# Altium project DM3370.PrjPcb (part 8 of 14)

## Sheet DM3370_Power.SchDoc: =project_title
size Tabloid; CompanyName: Luxonis Holding; DrawnBy: David Malovrh; Organization: Luxonis Holding; Address1: 7901 Shaffer Parkway; Address2: Littleton, CO; Address3: 80127; Address4: United States; DocumentNumber: 3; Revision: R5M2E5; SheetNumber: 3; SheetTotal: 17
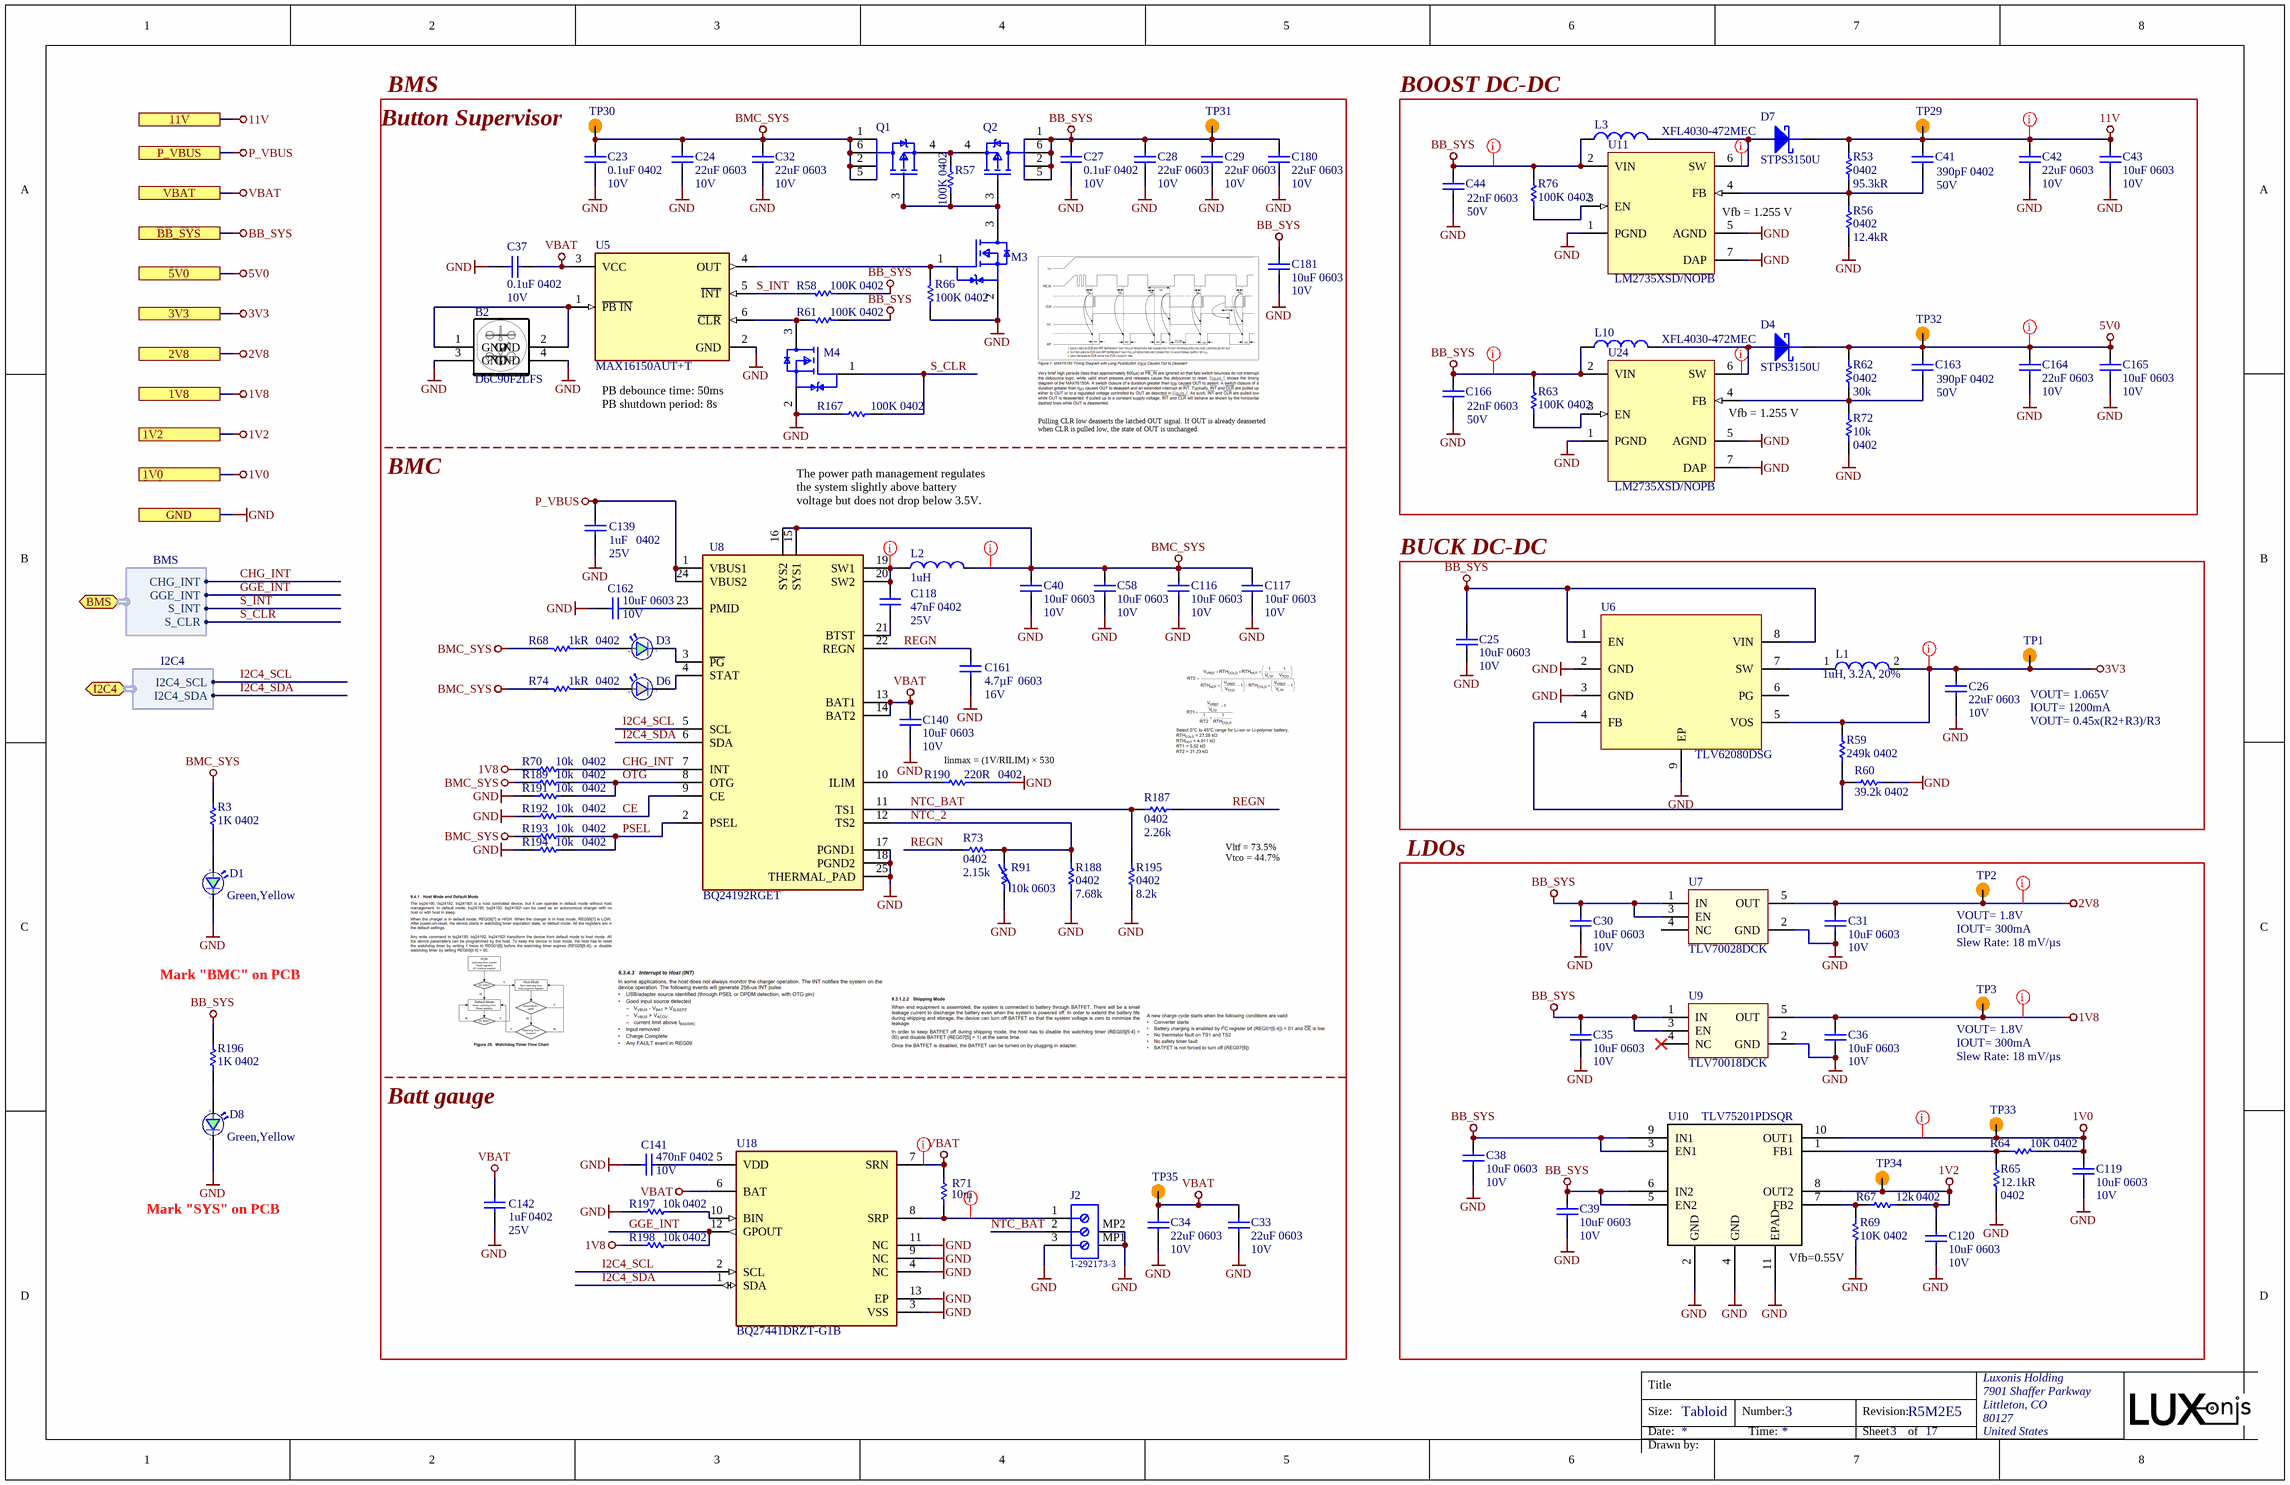
[diagram p13: DM3370_Power.SchDoc]

### Parts
B2  D6C90F2LFS  [CON_B_BW2099_SoM_DF40HC-3.0-100DS-0.4V_minpad]
C23  0.1uF 0402  Voltage Rating: 10V  [CAPC0402(1005)70_L]
C24  22uF 0603  Voltage Rating: 10V  [CAPC0603(1608)100_L]
C25  10uF 0603  Voltage Rating: 10V  [CAPC0603(1608)100_L]
C26  22uF 0603  Voltage Rating: 10V  [CAPC0603(1608)100_L]
C27  0.1uF 0402  Voltage Rating: 10V  [CAPC0402(1005)70_L]
C28  22uF 0603  Voltage Rating: 10V  [CAPC0603(1608)100_L]
C29  22uF 0603  Voltage Rating: 10V  [CAPC0603(1608)100_L]
C30  10uF 0603  Voltage Rating: 10V  [CAPC0603(1608)100_L]
C31  10uF 0603  Voltage Rating: 10V  [CAPC0603(1608)100_L]
C32  22uF 0603  Voltage Rating: 10V  [CAPC0603(1608)100_L]
C33  22uF 0603  Voltage Rating: 10V  [CAPC0603(1608)100_L]
C34  22uF 0603  Voltage Rating: 10V  [CAPC0603(1608)100_L]
C35  10uF 0603  Voltage Rating: 10V  [CAPC0603(1608)100_L]
C36  10uF 0603  Voltage Rating: 10V  [CAPC0603(1608)100_L]
C37  0.1uF 0402  Voltage Rating: 10V  [CAPC0402(1005)70_L]
C38  10uF 0603  Voltage Rating: 10V  [CAPC0603(1608)100_L]
C39  10uF 0603  Voltage Rating: 10V  [CAPC0603(1608)100_L]
C40  10uF 0603  Voltage Rating: 10V  [CAPC0603(1608)100_L]
C41  Rated DC Voltage (URdc): 50V  Capacitance: 390pF  Size Code: 0402  [CAPC0402(1005)60_L]  (hidden comment: GRM1555C1H391JA01J)
C42  22uF 0603  Voltage Rating: 10V  [CAPC0603(1608)100_L]
C43  10uF 0603  Voltage Rating: 10V  [CAPC0603(1608)100_L]
C44  Voltage Rating: 50V  Case Code (Imperial): 0603  Capacitance: 22nF  [CAPC0603(1608)100_L]  (hidden comment: C0603C223K5RACTU)
C58  10uF 0603  Voltage Rating: 10V  [CAPC0603(1608)100_L]
C116  10uF 0603  Voltage Rating: 10V  [CAPC0603(1608)100_L]
C117  10uF 0603  Voltage Rating: 10V  [CAPC0603(1608)100_L]
C118  Case Code (Imperial): 0402  Capacitance: 47nF  Voltage: 25V  [CAPC0402(1005)70_L]  (hidden comment: GRM155R71E473KA88D)
C119  10uF 0603  Voltage Rating: 10V  [CAPC0603(1608)100_L]
C120  10uF 0603  Voltage Rating: 10V  [CAPC0603(1608)100_L]
C139  Case Code (Imperial): 0402  Voltage: 25V  Capacitance: 1uF  [CAPC0402(1005)70_L]  (hidden comment: GRM155R61E105KA12D)
C140  10uF 0603  Voltage Rating: 10V  [CAPC0603(1608)100_L]
C141  Voltage Rating: 10V  Capacitance: 470nF  Case/Package: 0402  [CAPC0402(1005)70_L]  (hidden comment: GRM155R61A474KE15D)
C142  Case Code (Imperial): 0402  Voltage: 25V  Capacitance: 1uF  [CAPC0402(1005)70_L]  (hidden comment: GRM155R61E105KA12D)
C161  value 4.7µF  Voltage Rating: 16V  Case/Package: 0603  [CAPC0603(1608)100_L]  (hidden comment: GRM188R61C475KAAJD)
C162  10uF 0603  Voltage Rating: 10V  [CAPC0603(1608)100_L]
C163  Rated DC Voltage (URdc): 50V  Capacitance: 390pF  Size Code: 0402  [CAPC0402(1005)60_L]  (hidden comment: GRM1555C1H391JA01J)
C164  22uF 0603  Voltage Rating: 10V  [CAPC0603(1608)100_L]
C165  10uF 0603  Voltage Rating: 10V  [CAPC0603(1608)100_L]
C166  Voltage Rating: 50V  Case Code (Imperial): 0603  Capacitance: 22nF  [CAPC0603(1608)100_L]  (hidden comment: C0603C223K5RACTU)
C180  22uF 0603  Voltage Rating: 10V  [CAPC0603(1608)100_L]
C181  10uF 0603  Voltage Rating: 10V  [CAPC0603(1608)100_L]
D1  Color: Green,Yellow  [SML_D1xx8W]  (hidden comment: SML-D12M8WT86)
D3  SML-D12M8WT86  [SML_D1xx8W]  (value not drawn)
D4  STPS3150U  [FP-SMB-MFG]
D6  SML-D12D8WT86  [SML_D1xx8W]  (value not drawn)
D7  STPS3150U  [FP-SMB-MFG]
D8  Color: Green,Yellow  [SML_D1xx8W]  (hidden comment: SML-D12M8WT86)
J2  1-292173-3  [1-292173-3]
L1  1uH, 3.2A, 20%  [DFE252012P-1R0M=P2]
L2  Inductance: 1uH  [COIL-XFL4020_V]  (hidden comment: XFL4020-102MEC)
L3  XFL4030-472MEC  [XFL4030-472MEC-MFG]
L10  XFL4030-472MEC  [XFL4030-472MEC-MFG]
M3  RE1C002UNTCL  [RE1C002UNTCL]  (value not drawn)
M4  RE1C002UNTCL  [RE1C002UNTCL]  (value not drawn)
Q1  IRLTS2242TRPBF  [TSOP-6-MFG]  (value not drawn)
Q2  IRLTS2242TRPBF  [TSOP-6-MFG]  (value not drawn)
R3  1K 0402  [RESC0402(1005)_L]
R53  Case Code (Imperial): 0402  Resistance: 95.3kR  [RESC0402(1005)_L]  (hidden comment: CRCW040295K3FKED)
R56  Case Code (Imperial): 0402  Resistance: 12.4kR  [RESC0402(1005)_L]  (hidden comment: RC0402FR-0712K4L)
R57  100K 0402  [RESC0402(1005)_L]
R58  100K 0402  [RESC0402(1005)_L]
R59  249k 0402  [RESC0402(1005)_L]
R60  39.2k 0402  [RESC0402(1005)_L]
R61  100K 0402  [RESC0402(1005)_L]
R62  value 30k  Case/Package: 0402  [RESC0402(1005)_L]  (hidden comment: RC0402FR-0730KL)
R63  100K 0402  [RESC0402(1005)_L]
R64  10K 0402  [RESC0402(1005)_L]
R65  Resistance: 12.1kR  Size Code: 0402  [RESC0402(1005)_L]  (hidden comment: RC0402FR-0712K1L)
R66  100K 0402  [RESC0402(1005)_L]
R67  value 12k  Case/Package: 0402  [RESC0402(1005)_L]  (hidden comment: RC0402FR-0712KL)
R68  Case Code (Imperial): 0402  Resistance: 1kR  [RESC0402(1005)_L]  (hidden comment: RC0402FR-071KL)
R69  10K 0402  [RESC0402(1005)_L]
R70  value 10k  Case/Package: 0402  [RESC0402(1005)_L]  (hidden comment: RC0402FR-1310KL)
R71  value 10m  [RESC0805(2012)_M]  (hidden comment: ERJ-6BWFR010V)
R72  value 10k  Case/Package: 0402  [RESC0402(1005)_L]  (hidden comment: RC0402FR-1310KL)
R73  value 2.15k  Case/Package: 0402  [RESC0402(1005)_L]  (hidden comment: CRCW04022K15FKED)
R74  Case Code (Imperial): 0402  Resistance: 1kR  [RESC0402(1005)_L]  (hidden comment: RC0402FR-071KL)
R76  100K 0402  [RESC0402(1005)_L]
R91  value 10k  Case/Package: 0603  [RESC0603(1608)_N]  (hidden comment: NTCG163JF103FT1)
R167  100K 0402  [RESC0402(1005)_L]
R187  value 2.26k  Case/Package: 0402  [RESC0402(1005)_L]  (hidden comment: CRCW04022K26FKED)
R188  value 7.68k  Case/Package: 0402  [RESC0402(1005)_L]  (hidden comment: CRCW04027K68FKTD)
R189  value 10k  Case/Package: 0402  [RESC0402(1005)_L]  (hidden comment: RC0402FR-1310KL)
R190  Resistance: 220R  Case Code (Imperial): 0402  [RESC0402(1005)_L]  (hidden comment: RC0402FR-07220RL)
R191  value 10k  Case/Package: 0402  [RESC0402(1005)_L]  (hidden comment: RC0402FR-1310KL)
R192  value 10k  Case/Package: 0402  [RESC0402(1005)_L]  (hidden comment: RC0402FR-1310KL)
R193  value 10k  Case/Package: 0402  [RESC0402(1005)_L]  (hidden comment: RC0402FR-1310KL)
R194  value 10k  Case/Package: 0402  [RESC0402(1005)_L]  (hidden comment: RC0402FR-1310KL)
R195  value 8.2k  Case/Package: 0402  [RESC0402(1005)_L]  (hidden comment: CR0402-FX-8201GLF)
R196  1K 0402  [RESC0402(1005)_L]
R197  value 10k  Case/Package: 0402  [RESC0402(1005)_L]  (hidden comment: RC0402FR-1310KL)
R198  value 10k  Case/Package: 0402  [RESC0402(1005)_L]  (hidden comment: RC0402FR-1310KL)
TP1  TP100_200_NS  [TP100_200_NS]  (value not drawn)  (no BOM)
TP2  TP100_200_NS  [TP100_200_NS]  (value not drawn)  (no BOM)
TP3  TP100_200_NS  [TP100_200_NS]  (value not drawn)  (no BOM)
TP29  TP100_200_NS  [TP100_200_NS]  (value not drawn)  (no BOM)
TP30  TP100_200_NS  [TP100_200_NS]  (value not drawn)  (no BOM)
TP31  TP100_200_NS  [TP100_200_NS]  (value not drawn)  (no BOM)
TP32  TP100_200_NS  [TP100_200_NS]  (value not drawn)  (no BOM)
TP33  TP100_200_NS  [TP100_200_NS]  (value not drawn)  (no BOM)
TP34  TP100_200_NS  [TP100_200_NS]  (value not drawn)  (no BOM)
TP35  TP100_200_NS  [TP100_200_NS]  (value not drawn)  (no BOM)
U5  MAX16150AUT+T  [FP-U6-1-MFG]
U6  TLV62080DSG  [TLV62080DSG]
U7  TLV70028DCK  [TLV70028DCK]
U8  BQ24192RGET  [BQ24192IRGET-Footprint-1]
U9  TLV70018DCK  [TLV70018DCK]
U10  TLV75201PDSQR  [SON_1PDSQR_TEX]
U11  LM2735XSD/NOPB  [NGG0006A_V]
U18  BQ27441DRZT-G1B  [FP-DRZ0012A-MFG]
U24  LM2735XSD/NOPB  [NGG0006A_V]

### Blocks framed on the sheet
BOOST DC-DC: C41-C44 C163-C166 D4 D7 L3 L10 R53 R56 R62 R63 R72 R76 TP29 TP32 U11 U24
BUCK DC-DC: C25 C26 L1 R59 R60 TP1 U6
LDOs: C30 C31 C35 C36 C38 C39 C119 C120 R64 R65 R67 R69 TP2 TP3 TP33 TP34 U7 U9 U10

### Ports
1V0, 1V2, 1V8, 2V8, 3V3, 5V0, 11V, BB_SYS, BMS (bidir, harness BMS), GND, I2C4 (bidir, harness I2C4), P_VBUS, VBAT

### Harnesses
I2C4: I2C4_SCL, I2C4_SDA
BMS: CHG_INT, GGE_INT, S_INT, S_CLR

### Nets
1V0: C119.2 R64.2 TP33.1 U10.10(OUT1) ; port 1V0
1V2: C120.2 R67.1 TP34.1 U10.8(OUT2) ; port 1V2
1V8: C36.2 R70.1 R198.1 TP3.1 U9.5(OUT) ; port 1V8
2V8: C31.2 TP2.1 U7.5(OUT) ; port 2V8
3V3: C26.2 L1.2 R59.2 TP1.1 U6.5(VOS) ; port 3V3
5V0: C163.1 C164.2 C165.2 D4.1(K) R62.2 TP32.1 ; port 5V0
11V: C41.1 C42.2 C43.2 D7.1(K) R53.2 TP29.1 ; port 11V
BB_SYS: C25.2 C27.1 C28.2 C29.2 C30.2 C35.2 C38.2 C39.2 C44.2 C166.2 C180.2 C181.2 L3.1 L10.1 Q2.1(D) Q2.2(D) Q2.5(D) Q2.6(D) R58.2 R61.2 R63.2 R76.2 R196.2 TP31.1 U6.1(EN) U6.8(VIN) U7.1(IN) U7.3(EN) U9.1(IN) U9.3(EN) U10.3(EN1) U10.5(EN2) U10.6(IN2) U10.9(IN1) U11.2(VIN) U24.2(VIN) ; port BB_SYS
BMC_SYS: C23.1 C24.2 C32.2 C40.2 C58.2 C116.2 C117.2 L2.2 Q1.1(D) Q1.2(D) Q1.5(D) Q1.6(D) R3.2 R68.1 R74.1 R189.1 R193.1 TP30.1 U8.15(SYS1) U8.16(SYS2)
GND: B2.3(GND) B2.4(GND) C23.2 C24.1 C25.1 C26.1 C27.2 C28.1 C29.1 C30.1 C31.1 C32.1 C33.1 C34.1 C35.1 C36.1 C37.2 C38.1 C39.1 C40.1 C42.1 C43.1 C44.1 C58.1 C116.1 C117.1 C119.1 C120.1 C139.2 C140.1 C141.2 C142.2 C161.1 C162.2 C164.1 C165.1 C166.1 C180.1 C181.1 D1.1(C) D8.1(C) J2.3 J2.MP1 J2.MP2 M3.2(Source) M4.2(Source) R56.1 R60.1 R65.1 R66.1 R69.2 R72.1 R91.1 R167.1 R188.1 R190.1 R191.1 R192.1 R194.1 R195.1 R197.1 U5.2(GND) U6.2(GND) U6.3(GND) U6.9(EP) U7.2(GND) U8.17(PGND1) U8.18(PGND2) U8.25(THERMAL_PAD) U9.2(GND) U10.2(GND) U10.4(GND) U10.11(EPAD) U11.1(PGND) U11.5(AGND) U11.7(DAP) U18.3(VSS) U18.4(NC) U18.9(NC) U18.11(NC) U18.13(EP) U24.1(PGND) U24.5(AGND) U24.7(DAP) ; port GND
P_VBUS: C139.1 U8.1(VBUS1) U8.24(VBUS2) ; port P_VBUS
VBAT: C33.2 C34.2 C37.1 C140.2 C142.1 R71.1 TP35.1 U5.3(VCC) U8.13(BAT1) U8.14(BAT2) U18.6(BAT) U18.7(SRN) ; port VBAT
CE: R192.2 U8.9(CE)
CHG_INT: R70.2 U8.7(INT) ; port BMS.CHG_INT
GGE_INT: R198.2 U18.12(GPOUT) ; port BMS.GGE_INT
I2C4_SCL: U8.5(SCL) U18.2(SCL) ; port I2C4.I2C4_SCL
I2C4_SDA: U8.6(SDA) U18.1(SDA) ; port I2C4.I2C4_SDA
NTC_2: R73.2 R91.2 R188.2 U8.12(TS2)
NTC_BAT: J2.2 R187.1 R195.2 U8.11(TS1)
OTG: R189.2 R191.2 U8.8(OTG)
PSEL: R193.2 R194.2 U8.2(PSEL)
REGN: C161.2 R73.1 R187.2 U8.22(REGN)
S_CLR: M4.1(Gate) R167.2 ; port BMS.S_CLR
S_INT: R58.1 U5.5(~{INT}) ; port BMS.S_INT
NetB2_1: B2.1(GND) B2.2(GND) U5.1(~{PB_IN})
NetC41_2: C41.2 R53.1 R56.2 U11.4(FB)
NetC118_1: C118.1 U8.21(BTST)
NetC118_2: C118.2 L2.1 U8.19(SW1) U8.20(SW2)
NetC141_1: C141.1 U18.5(VDD)
NetC162_1: C162.1 U8.23(PMID)
NetC163_2: C163.2 R62.1 R72.2 U24.4(FB)
NetD1_2: D1.2(A) R3.1
NetD3_1: D3.1(C) U8.3(~{PG})
NetD3_2: D3.2(A) R68.2
NetD4_2: D4.2(A) L10.2 U24.6(SW)
NetD6_1: D6.1(C) U8.4(STAT)
NetD6_2: D6.2(A) R74.2
NetD7_2: D7.2(A) L3.2 U11.6(SW)
NetD8_2: D8.2(A) R196.1
NetJ2_1: J2.1 R71.2 U18.8(SRP)
NetL1_1: L1.1 U6.7(SW)
NetM3_1: M3.1(Gate) R66.2 U5.4(OUT)
NetM3_3: M3.3(Drain) Q1.3(G) Q2.3(G) R57.2
NetM4_3: M4.3(Drain) R61.1 U5.6(~{CLR})
NetQ1_4: Q1.4(S) Q2.4(S) R57.1
NetR59_1: R59.1 R60.2 U6.4(FB)
NetR63_1: R63.1 U24.3(EN)
NetR64_1: R64.1 R65.2 U10.1(FB1)
NetR67_2: R67.2 R69.1 U10.7(FB2)
NetR76_1: R76.1 U11.3(EN)
NetR190_2: R190.2 U8.10(ILIM)
NetR197_2: R197.2 U18.10(BIN)

Not connected (* = marked no-connect by the designer): U6 6(PG); U7 4(NC); U9 4(NC)*

### Layout directives
net class Power_trace: 1V0, 1V8, 2V8, 3V3, 5V0, 11V, BB_SYS, BMC_SYS, NetC118_2, NetD4_2, NetD7_2, NetJ2_1, VBAT

### Notes on the sheet
- BMS
- (near TP30) Button Supervisor
- (near U11) Vfb = 1.255 V
- (near U5) PB debounce time: 50ms
  PB shutdown period: 8s
- Pulling CLR low deasserts the latched OUT signal. If OUT is already deasserted when CLR is pulled low, the state of OUT is unchanged.
- (near U24) Vfb = 1.255 V
- BMC
- The power path management regulates the system slightly above battery voltage but does not drop below 3.5V.
- (near TP1) VOUT= 1.065V
- (near R190) Iinmax = (1V/RILIM) × 530
- IOUT= 1200mA
- VOUT= 0.45x(R2+R3)/R3
- Vltf = 73.5%
  Vtco = 44.7%
- (near TP2) VOUT= 1.8V
- (near TP2) IOUT= 300mA
- Slew Rate: 18 mV/µs
- Mark "BMC" on PCB
- (near TP3) VOUT= 1.8V
- Batt gauge
- (near TP3) IOUT= 300mA
- Mark "SYS" on PCB
- Vfb=0.55V
- Title
- Size:
- Date:
- Tabloid
- Number:
- Time:
- Revision:
- Sheet
- of
- Drawn by: